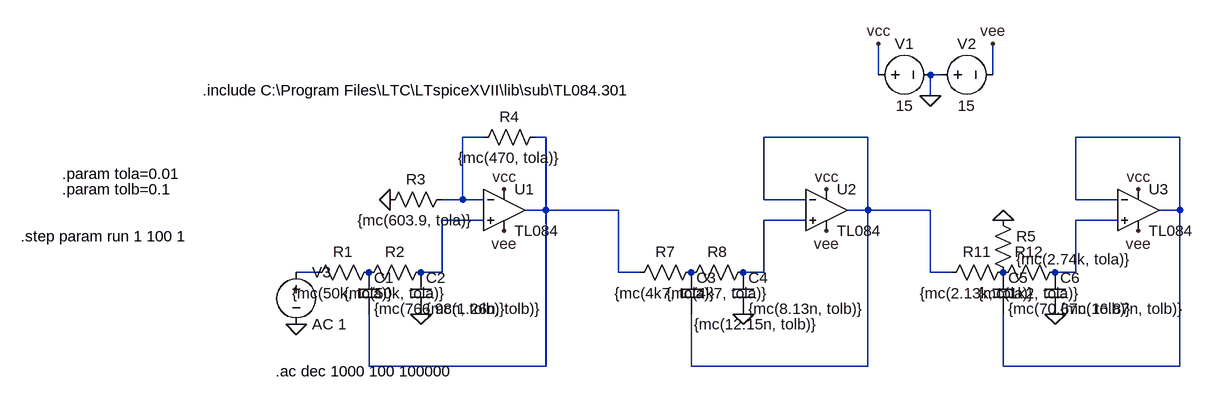
[diagram p0: schematic bessel mont.asc]
bessel mont.asc, the LTspice schematic file:
Version 4
SHEET 1 1300 680
WIRE 736 -48 736 -96
WIRE 832 -48 816 -48
WIRE 912 -48 912 -96
WIRE 816 -16 816 -48
WIRE 128 48 96 48
WIRE 224 48 208 48
WIRE 720 48 560 48
WIRE 1200 48 1040 48
WIRE 96 144 96 48
WIRE 96 144 64 144
WIRE 128 144 96 144
WIRE 560 144 560 48
WIRE 624 144 560 144
WIRE 1040 144 1040 48
WIRE 1104 144 1040 144
WIRE 224 160 224 48
WIRE 224 160 192 160
WIRE 336 160 224 160
WIRE 720 160 720 48
WIRE 720 160 688 160
WIRE 816 160 720 160
WIRE 1200 160 1200 48
WIRE 1200 160 1168 160
WIRE 128 176 64 176
WIRE 624 176 560 176
WIRE 1104 176 1040 176
WIRE -128 256 -160 256
WIRE 64 256 64 176
WIRE 64 256 32 256
WIRE 336 256 336 160
WIRE 368 256 336 256
WIRE 560 256 560 176
WIRE 560 256 528 256
WIRE 816 256 816 160
WIRE 848 256 816 256
WIRE 1040 256 1040 176
WIRE 1040 256 1008 256
WIRE -48 400 -48 320
WIRE 224 400 224 160
WIRE 224 400 -48 400
WIRE 448 400 448 320
WIRE 720 400 720 160
WIRE 720 400 448 400
WIRE 928 400 928 320
WIRE 1200 400 1200 160
WIRE 1200 400 928 400
FLAG -16 144 0
FLAG 32 320 0
FLAG 528 320 0
FLAG 1008 320 0
FLAG 928 176 0
FLAG 736 -96 vcc
FLAG 656 128 vcc
FLAG 160 128 vcc
FLAG 1136 128 vcc
FLAG 912 -96 vee
FLAG 656 192 vee
FLAG 160 192 vee
FLAG 1136 192 vee
FLAG 816 -16 0
FLAG -160 336 0
SYMBOL res 80 128 R90
WINDOW 0 0 56 VBottom 2
WINDOW 3 32 56 VTop 2
SYMATTR InstName R3
SYMATTR Value {mc(603.9, tola)}
SYMBOL res 224 32 R90
WINDOW 0 0 56 VBottom 2
WINDOW 3 32 56 VTop 2
SYMATTR InstName R4
SYMATTR Value {mc(470, tola)}
SYMBOL res -32 240 R90
WINDOW 0 0 56 VBottom 2
WINDOW 3 32 56 VTop 2
SYMATTR InstName R1
SYMATTR Value {mc(50k, tola)}
SYMBOL cap -64 256 R0
SYMATTR InstName C1
SYMATTR Value {mc(766.98n, tolb)}
SYMBOL res 48 240 R90
WINDOW 0 0 56 VBottom 2
WINDOW 3 32 56 VTop 2
SYMATTR InstName R2
SYMATTR Value {mc(50k, tola)}
SYMBOL cap 16 256 R0
SYMATTR InstName C2
SYMATTR Value {mc(1.26n, tolb)}
SYMBOL res 464 240 R90
WINDOW 0 0 56 VBottom 2
WINDOW 3 32 56 VTop 2
SYMATTR InstName R7
SYMATTR Value {mc(4k7, tola)}
SYMBOL cap 432 256 R0
WINDOW 3 20 80 Left 2
SYMATTR InstName C3
SYMATTR Value {mc(12.15n, tolb)}
SYMBOL res 544 240 R90
WINDOW 0 0 56 VBottom 2
WINDOW 3 32 56 VTop 2
SYMATTR InstName R8
SYMATTR Value {mc(4k7, tola)}
SYMBOL cap 512 256 R0
SYMATTR InstName C4
SYMATTR Value {mc(8.13n, tolb)}
SYMBOL res 944 240 R90
WINDOW 0 0 56 VBottom 2
WINDOW 3 32 56 VTop 2
SYMATTR InstName R11
SYMATTR Value {mc(2.13k, tola)}
SYMBOL cap 912 256 R0
SYMATTR InstName C5
SYMATTR Value {mc(70.67n, tolb)}
SYMBOL res 1024 240 R90
WINDOW 0 0 56 VBottom 2
WINDOW 3 32 56 VTop 2
SYMATTR InstName R12
SYMATTR Value {mc(1k2, tola)}
SYMBOL cap 992 256 R0
SYMATTR InstName C6
SYMATTR Value {mc(16.87n, tolb)}
SYMBOL res 912 160 R0
SYMATTR InstName R5
SYMATTR Value {mc(2.74k, tola)}
SYMBOL voltage 720 -48 R270
WINDOW 0 32 56 VTop 2
WINDOW 3 -32 56 VBottom 2
WINDOW 123 0 0 Left 0
WINDOW 39 0 0 Left 0
SYMATTR InstName V1
SYMATTR Value 15
SYMBOL voltage 816 -48 R270
WINDOW 0 32 56 VTop 2
WINDOW 3 -32 56 VBottom 2
WINDOW 123 0 0 Left 0
WINDOW 39 0 0 Left 0
SYMATTR InstName V2
SYMATTR Value 15
SYMBOL Opamps\\opamp2 160 96 R0
SYMATTR InstName U1
SYMATTR Value TL084
SYMBOL Opamps\\opamp2 656 96 R0
SYMATTR InstName U2
SYMATTR Value TL084
SYMBOL Opamps\\opamp2 1136 96 R0
SYMATTR InstName U3
SYMATTR Value TL084
SYMBOL voltage -160 240 R0
SYMATTR InstName V3
SYMATTR Value AC 1
TEXT -192 408 Left 2 !.ac dec 1000 100 100000
TEXT -304 -24 Left 2 !.include C:\\Program Files\\LTC\\LTspiceXVII\\lib\\sub\\TL084.301
TEXT -520 104 Left 2 !.param tola=0.01
TEXT -520 128 Left 2 !.param tolb=0.1
TEXT -584 200 Left 2 !.step param run 1 100 1

The netlist it stands for:
* bessel mont.asc
R3 N001 0 {mc(603.9, tola)}
R4 N002 N001 {mc(470, tola)}
R1 P001 N008 {mc(50k, tola)}
C1 P001 N002 {mc(766.98n, tolb)}
R2 N005 P001 {mc(50k, tola)}
C2 N005 0 {mc(1.26n, tolb)}
R7 P002 N002 {mc(4k7, tola)}
C3 P002 N003 {mc(12.15n, tolb)}
R8 N006 P002 {mc(4k7, tola)}
C4 N006 0 {mc(8.13n, tolb)}
R11 P003 N003 {mc(2.13k, tola)}
C5 P003 N004 {mc(70.67n, tolb)}
R12 N007 P003 {mc(1k2, tola)}
C6 N007 0 {mc(16.87n, tolb)}
R5 0 P003 {mc(2.74k, tola)}
V1 vcc 0 15
V2 0 vee 15
XU1 N005 N001 vcc vee N002 TL084  ; pins In+ In- V+ V- OUT
XU2 N006 N003 vcc vee N003 TL084  ; pins In+ In- V+ V- OUT
XU3 N007 N004 vcc vee N004 TL084  ; pins In+ In- V+ V- OUT
V3 N008 0 AC 1
.ac dec 1000 100 100000
.include C:\Program Files\LTC\LTspiceXVII\lib\sub\TL084.301
.param tola=0.01
.param tolb=0.1
.step param run 1 100 1
.backanno
.end